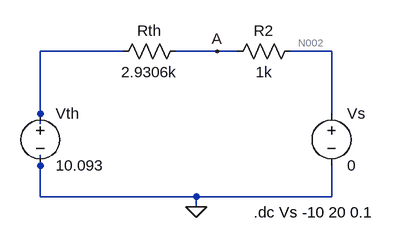
[diagram p0: schematic Circuit - 7.asc]
Circuit - 7.asc, the LTspice schematic file:
Version 4
SHEET 1 880 680
WIRE 176 32 48 32
WIRE 320 32 256 32
WIRE 352 32 320 32
WIRE 496 32 432 32
WIRE 48 128 48 32
WIRE 496 128 496 32
WIRE 48 144 48 128
WIRE 48 208 48 192
WIRE 48 256 48 208
WIRE 288 256 48 256
WIRE 496 256 496 208
WIRE 496 256 288 256
WIRE 288 272 288 256
FLAG 288 272 0
FLAG 320 32 A
SYMBOL voltage 48 112 R0
SYMATTR InstName Vth
SYMATTR Value 10.093
SYMBOL voltage 496 112 R0
SYMATTR InstName Vs
SYMATTR Value 0
SYMBOL res 272 16 R90
WINDOW 0 0 56 VBottom 2
WINDOW 3 32 56 VTop 2
SYMATTR InstName Rth
SYMATTR Value 2.9306k
SYMBOL res 448 16 R90
WINDOW 0 0 56 VBottom 2
WINDOW 3 32 56 VTop 2
SYMATTR InstName R2
SYMATTR Value 1k
TEXT 376 280 Left 2 !.dc Vs -10 20 0.1

The netlist it stands for:
* Circuit - 7.asc
Vth N001 0 10.093
Vs N002 0 0
Rth A N001 2.9306k
R2 N002 A 1k
.dc Vs -10 20 0.1
.backanno
.end

* Results of the author's LTspice run, read from the files saved beside the schematic
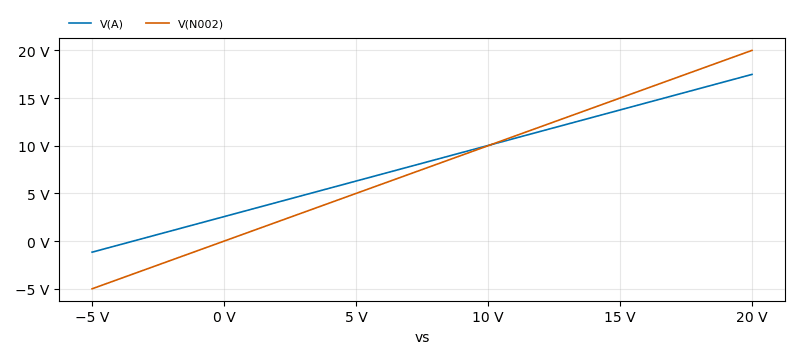
[diagram p1: DC transfer characteristic of Circuit - 7.asc, plotted from the saved traces]
* DC transfer characteristic, 1 run:
*   V(A): -1.16 V at vs=-5 V, 17.48 V at vs=20 V, min -1.16 V, max 17.48 V
*   V(N002): -5 V at vs=-5 V, 20 V at vs=20 V, min -5 V, max 20 V